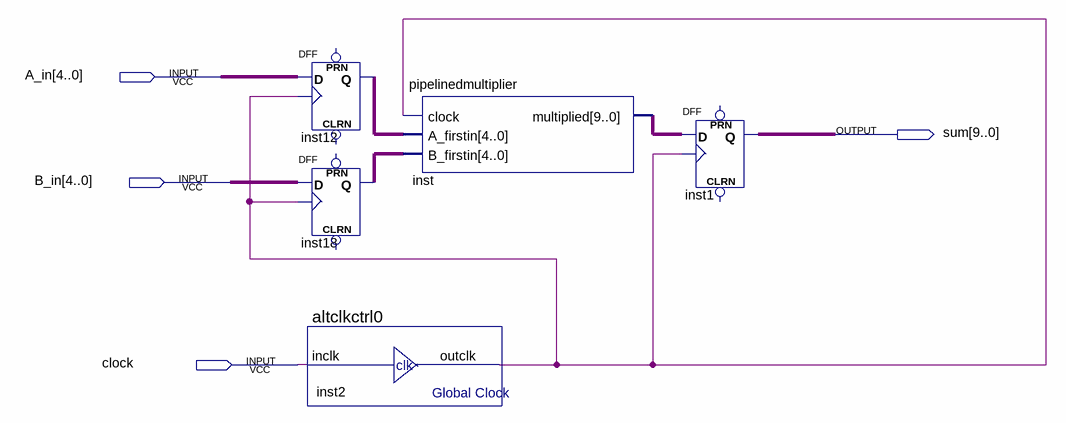
[diagram p0: schematic sheet]
// Quartus schematic registeredmultiplier.bdf as structural Verilog: 5 symbols, 4 pins
module registeredmultiplier (
  input  [4:0] A_in,
  input  [4:0] B_in,
  input  clock,
  output [9:0] sum
);

  wire inst2_outclk;
  wire [4:0] inst12_q, inst18_q;
  wire [9:0] inst_multiplied;

  DFF inst12[4:0] (.CLK(inst2_outclk), .D(A_in), .Q(inst12_q));  // open: CLRN, PRN
  DFF inst18[4:0] (.CLK(inst2_outclk), .D(B_in), .Q(inst18_q));  // open: CLRN, PRN
  altclkctrl0 inst2 (.inclk(clock), .outclk(inst2_outclk));
  pipelinedmultiplier inst (
    .clock(inst2_outclk), .A_firstin(inst12_q), .B_firstin(inst18_q), .multiplied(inst_multiplied));
  DFF inst1[9:0] (.CLK(inst2_outclk), .D(inst_multiplied), .Q(sum));  // open: CLRN, PRN
endmodule
